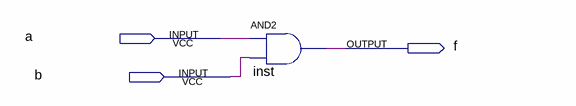
[diagram p0: schematic sheet]
// Quartus schematic de1000.bdf as structural Verilog: 1 symbols, 3 pins
module de1000 (
  input  a,
  input  b,
  output f
);

  and inst (f, a, b);
endmodule
